# EAGLE design Sensor PCB (EAGLE 7.6.0)
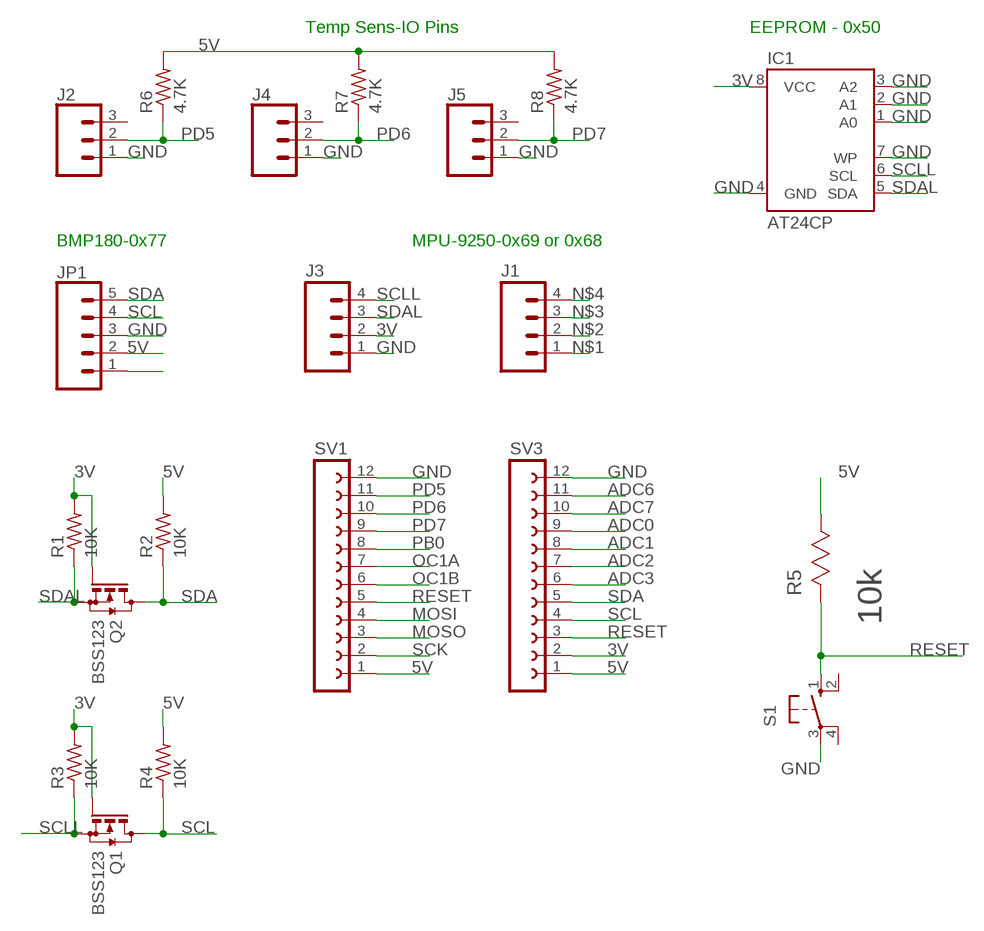
[diagram p0: schematic, sheet 1]

## Parts
IC1  AT24CP  [DIL08]
J1  M04PTH  [1X04]
J2  CONN_03  [1X03]
J3  M04PTH  [1X04]
J4  CONN_03  [1X03]
J5  CONN_03  [1X03]
JP1  CONN_05  [1X05]
Q1  BSS123  [SOT23]
Q2  BSS123  [SOT23]
R1  10K  R-US_M1406  [M1406]
R2  10K  R-US_M1406  [M1406]
R3  10K  R-US_M1406  [M1406]
R4  10K  R-US_M1406  [M1406]
R5  10k  CRCW08051M00JNEA  [RESC2013X65N]
R6  4.7K  R-US_M1406  [M1406]
R7  4.7K  R-US_M1406  [M1406]
R8  4.7K  R-US_M1406  [M1406]
S1  10-XX  [B3F-10XX]
SV1  FE12-1  [FE12]
SV3  FE12-1  [FE12]

## Nets
3V: IC1.8(VCC) J3.2 Q1.1(G) Q2.1(G) R1.2 R3.2 SV3.2
5V: JP1.2 R2.2 R4.2 R5.1 R6.2 R7.2 R8.2 SV1.1 SV3.1
ADC0: SV3.9
ADC1: SV3.8
ADC2: SV3.7
ADC3: SV3.6
ADC6: SV3.11
ADC7: SV3.10
GND: IC1.1(A0) IC1.2(A1) IC1.3(A2) IC1.4(GND) IC1.7(WP) J2.1 J3.1 J4.1 J5.1 JP1.3 S1.3(P) SV1.12 SV3.12
MOSI: SV1.4
MOSO: SV1.3
N$1: J1.1
N$2: J1.2
N$3: J1.3
N$4: J1.4
N$5: JP1.1
OC1A: SV1.7
OC1B: SV1.6
PB0: SV1.8
PD5: J2.2 R6.1 SV1.11
PD6: J4.2 R7.1 SV1.10
PD7: J5.2 R8.1 SV1.9
RESET: R5.2 S1.1(S) SV1.5 SV3.3
SCK: SV1.2
SCL: JP1.4 Q1.3(D) R4.1 SV3.4
SCLL: IC1.6(SCL) J3.4 Q1.2(S) R3.1
SDA: JP1.5 Q2.3(D) R2.1 SV3.5
SDAL: IC1.5(SDA) J3.3 Q2.2(S) R1.1
Unconnected: J2.3 J4.3 J5.3 S1.2(S1) S1.4(P1)

## Notes on the sheet
- Temp Sens-IO Pins | EEPROM - 0x50
- BMP180-0x77 | MPU-9250-0x69 or 0x68

## Library data of the parts
IC1 = atmel:AT24C*: 2-wire serial EEPROM; MPN: AT24C1024BW-SH-B; OC_FARNELL: 1362646; OC_NEWARK: 03P2044
J1 J3 = SparkFun-Connectors:M04: Header 4 Standard 4-pin 0.1" header. Use with straight break away headers (SKU : PRT-00116), right angle break away headers (PRT-00553), swiss pins (PRT-00743), machine pins (PRT-00117), and female headers (PRT-00115). Molex polarized connector foot print use with SKU : PRT-08231 with associated crimp pins and housings. 1MM SMD Version SKU: PRT-10208; PROD_ID: CONN-09696
J2 J4 J5 = SparkFun-Connectors:CONN_03: Multi connection point. Often used as Generic Header-pin footprint for 0.1 inch spaced/style header connections On any of the 0.1 inch spaced packages, you can populate with these: Break Away Headers - Straight <https://www.sparkfun.com/products/116> (PRT-00116) Break Away Male Headers - Right Angle <https://www.sparkfun.com/products/553> (PRT-00553) Female Headers <https://www.sparkfun.com/products/115> (PRT-00115) Break Away Headers - Machine Pin <https://www.sparkfun.com/products/117> (PRT-00117) Break Away Female Headers - Swiss Machine Pin <https://www.sparkfun.com/products/743> (PRT-00743) Stackable Header - 3 Pin (Female, 0.1") <https://www.sparkfun.com/products/13875> (PRT-13875) For SCREWTERMINALS and SPRING TERMINALS visit here: Screw Terimnals on SparkFun.com <https://www.sparkfun.com/search/results?term=Screw+Terminals> (5mm/3.5mm/2.54mm spacing) This device is also useful as a general connection point to wire up your design to another part of your project. Our various solder wires solder well into these plated through hole pads. Hook-Up Wire - Assortment (Stranded, 22 AWG) <https://www.sparkfun.com/products/11375> (PRT-11375) Hook-Up Wire - Assortment (Solid Core, 22 AWG) <https://www.sparkfun.com/products/11367> (PRT-11367) View the entire wire category on our website here <https://www.sparkfun.com/categories/141> Special notes: Molex polarized connector foot print use with SKU : PRT-08232 with associated crimp pins and housings.
JP1 = SparkFun-Connectors:CONN_05: Multi connection point. Often used as Generic Header-pin footprint for 0.1 inch spaced/style header connections On any of the 0.1 inch spaced packages, you can populate with these: Break Away Headers - Straight <https://www.sparkfun.com/products/116> (PRT-00116) Break Away Male Headers - Right Angle <https://www.sparkfun.com/products/553> (PRT-00553) Female Headers <https://www.sparkfun.com/products/115> (PRT-00115) Break Away Headers - Machine Pin <https://www.sparkfun.com/products/117> (PRT-00117) Break Away Female Headers - Swiss Machine Pin <https://www.sparkfun.com/products/743> (PRT-00743) For SCREWTERMINALS and SPRING TERMINALS visit here: Screw Terimnals on SparkFun.com <https://www.sparkfun.com/search/results?term=Screw+Terminals> (5mm/3.5mm/2.54mm spacing) This device is also useful as a general connection point to wire up your design to another part of your project. Our various solder wires solder well into these plated through hole pads. Hook-Up Wire - Assortment (Stranded, 22 AWG) <https://www.sparkfun.com/products/11375> (PRT-11375) Hook-Up Wire - Assortment (Solid Core, 22 AWG) <https://www.sparkfun.com/products/11367> (PRT-11367) View the entire wire category on our website here <https://www.sparkfun.com/categories/141> Special notes: Molex polarized connector foot print use with SKU : PRT-08231 with associated crimp pins and housings. 1MM SMD Version SKU: PRT-10208
Q1 Q2 = transistor-small-signal:BSS123: N-CHANNEL MOS FET
R1-R4 R6-R8 = resistor:R-US_: RESISTOR, American symbol
R5 = Vishay_By_element14_Batch_1:CRCW08051M00JNEA: RESISTOR, 0805; MPN: CRCW08051M00JNEA; OC_FARNELL: 1514803; OC_NEWARK: 59M6845; SUPPLIER: Vishay; TOLERANCE: ± 5.0 %; VALUE: 1M Ohms; WATTAGE: 0.125W
S1 = switch-omron:10-XX: OMRON SWITCH; MPN: B3F-1000; OC_FARNELL: 176432; OC_NEWARK: 36M3542
SV1 SV3 = con-lsta:FE12-1: FEMALE HEADER; OC_FARNELL: unknown; OC_NEWARK: unknown

## Board
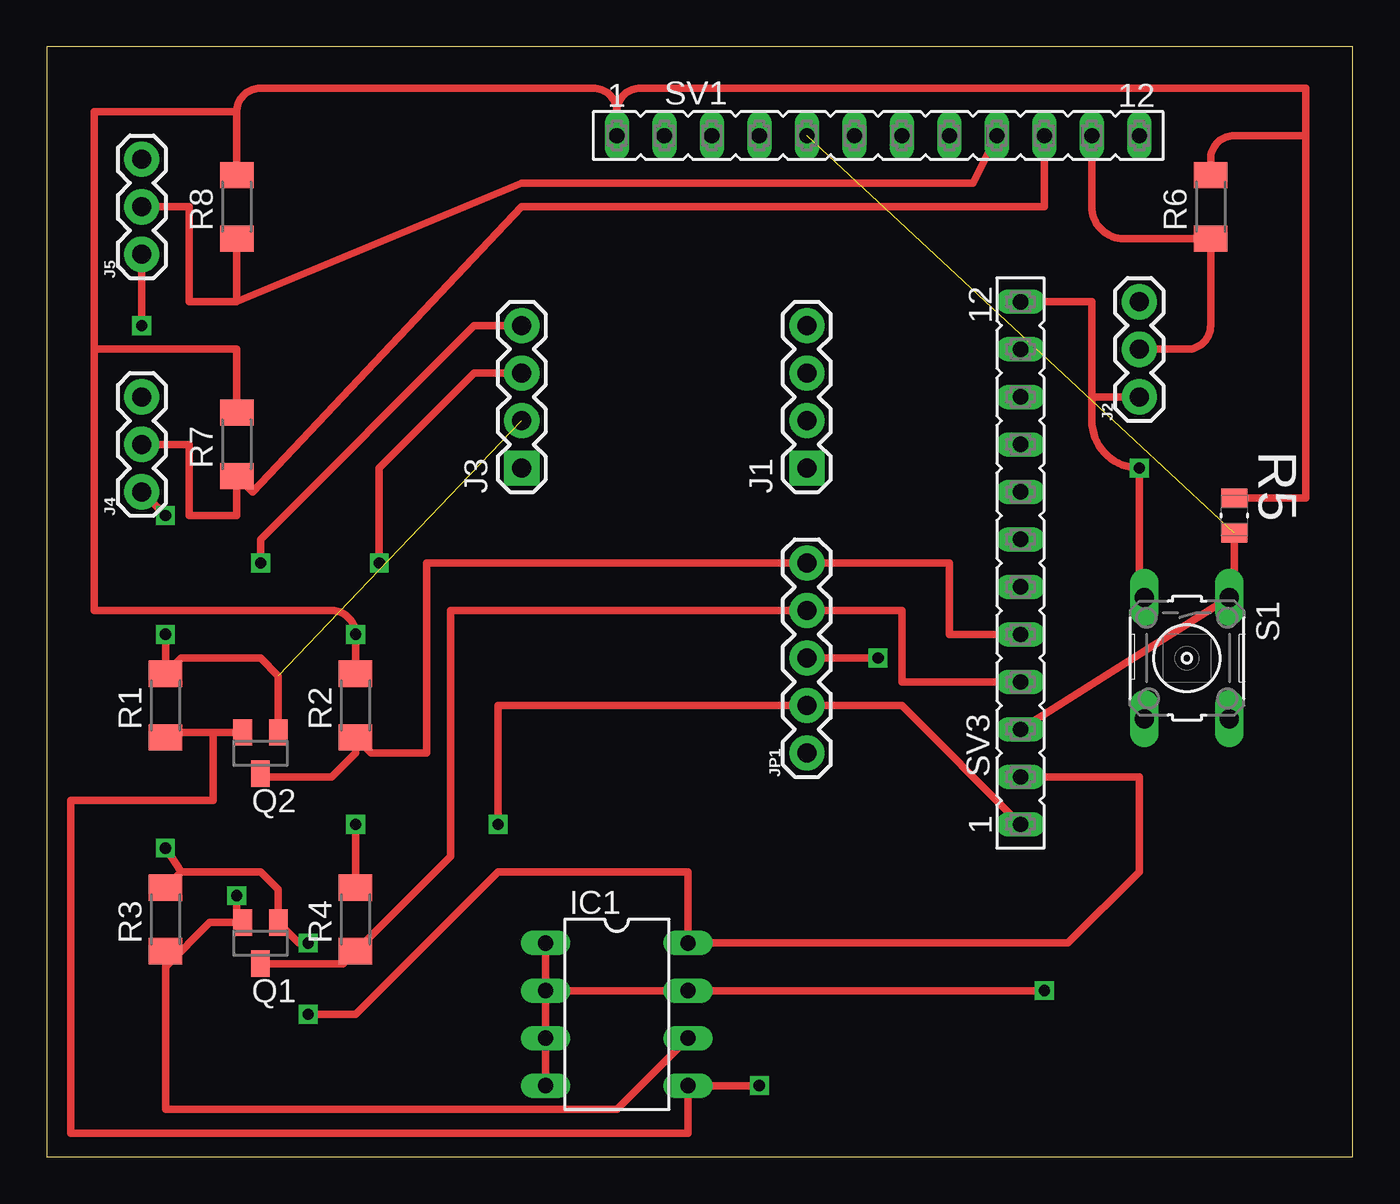
[diagram p1: board, top side]
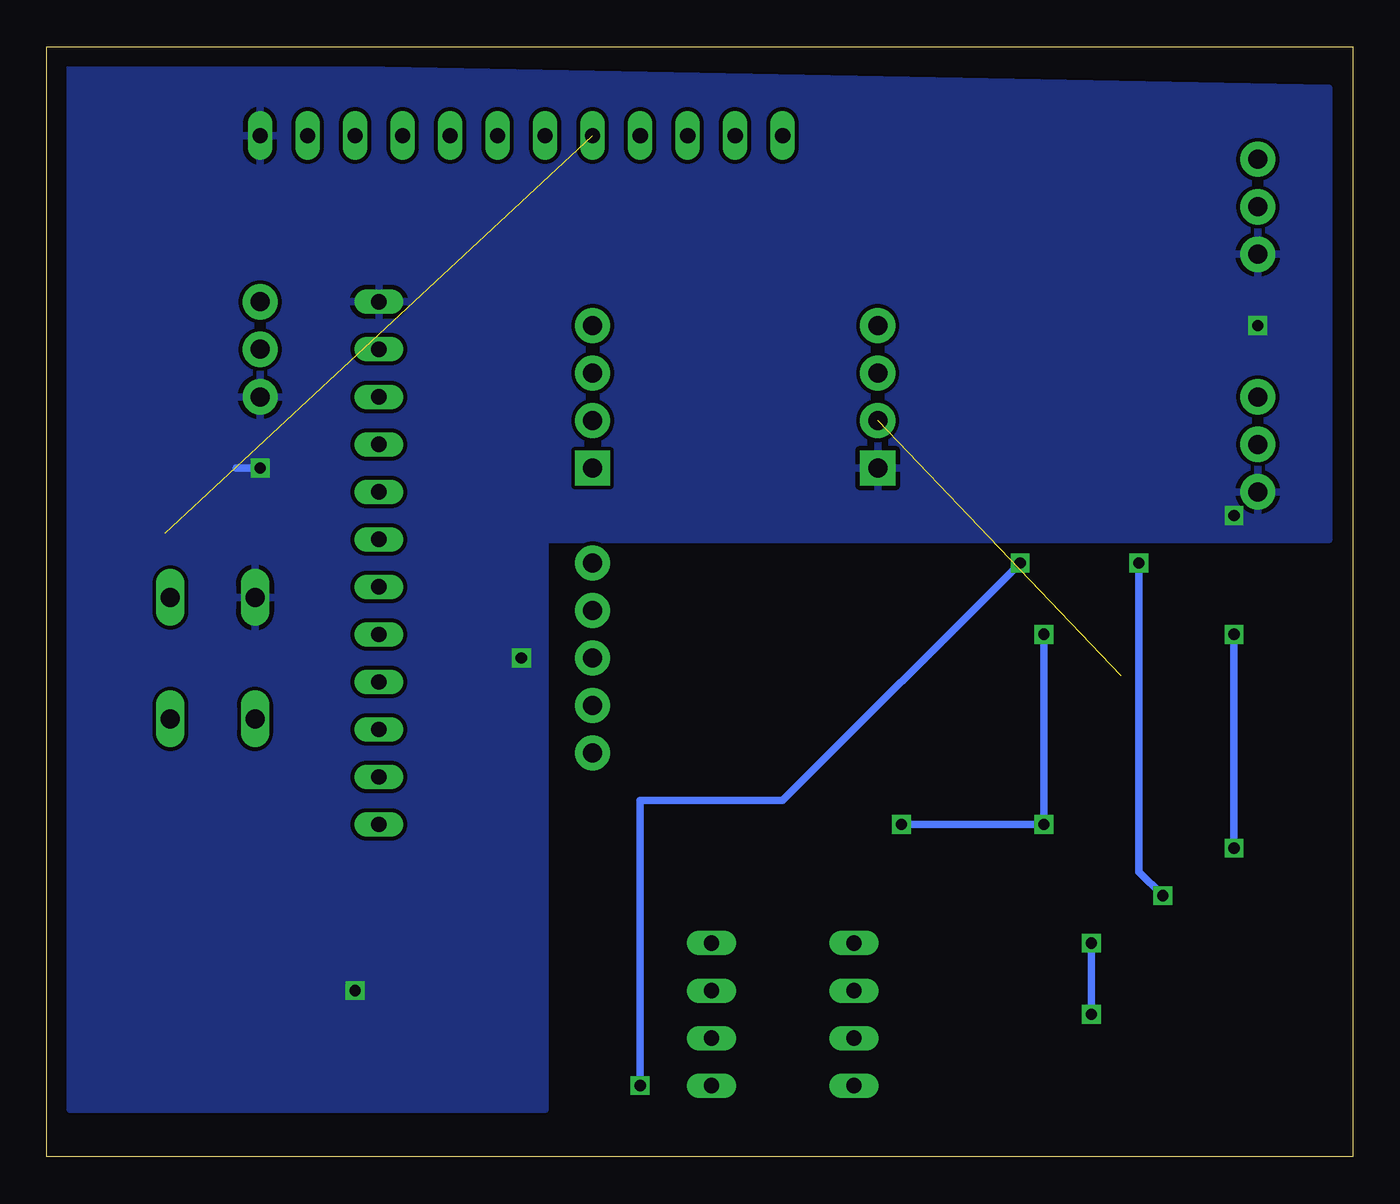
[diagram p2: board, bottom side, seen from below]

Size 69.83 x 59.36 mm. Coordinates in mm from the lower left corner, seen from the top.
Outline: 0,0 69.83,0 69.83,59.36 0,59.36 0,0
Copper layers (1*16): Top 0.035mm / dielectric 1.5mm / Bottom 0.035mm
Design rules "default": minimum track width 10mil, minimum drill 24mil, track to track 8mil, track to pad 8mil, pad to pad 8mil, via to via 8mil, smd to smd 8mil, copper to edge 40mil, drill to drill 8mil, minimum pad ring 10mil, minimum via ring 8mil, stop-mask expansion 4mil, vias tented up to drill 0mil, thermal gap 10mil

### Footprints (pad centres in the part's own frame; a part is rotated, then mirrored left to right if it is on the bottom)
DIL08 = drill 0.813 long: 1 -3.81,-3.81; 2 -1.27,-3.81; 3 1.27,-3.81; 4 3.81,-3.81; 5 3.81,3.81; 6 1.27,3.81; 7 -1.27,3.81; 8 -3.81,3.81
1X04 = drill 1.016 pad 1.88 square: 1 0,0 | drill 1.016 pad 1.88: 2 2.54,0; 3 5.08,0; 4 7.62,0
1X03 = drill 1.016 pad 1.88: 1 0,0; 2 2.54,0; 3 5.08,0
1X05 = drill 1.016 pad 1.88: 1 0,0; 2 2.54,0; 3 5.08,0; 4 7.62,0; 5 10.16,0
SOT23 = smd 1 x 1.4: 1 -0.95,-1.1; 2 0.95,-1.1; 3 0,1.1
M1406 = smd 1.4 x 1.8: 1 -1.7,0; 2 1.7,0
RESC2013X65N = smd 1.016 x 1.397: 1 -0.94,0; 2 0.94,0
B3F-10XX = drill 1.016 long: 1 -3.251,2.261; 2 3.251,2.261; 3 -3.251,-2.261; 4 3.251,-2.261
FE12 = drill 0.813 long: 1 -13.97,0; 2 -11.43,0; 3 -8.89,0; 4 -6.35,0; 5 -3.81,0; 6 -1.27,0; 7 1.27,0; 8 3.81,0; 9 6.35,0; 10 8.89,0; 11 11.43,0; 12 13.97,0

### Placement (x,y rotation side)
IC1  30.48,7.62 270 top
J1  40.64,36.83 90 top
J2  58.42,40.64 90 top
J3  25.4,36.83 90 top
J4  5.08,35.56 90 top
J5  5.08,48.26 90 top
JP1  40.64,21.59 90 top
Q1  11.43,11.43 180 top
Q2  11.43,21.59 180 top
R1  6.35,24.13 90 top
R2  16.51,24.13 90 top
R3  6.35,12.7 90 top
R4  16.51,12.7 90 top
R5  63.5,34.29 270 top
R6  62.23,50.8 90 top
R7  10.16,38.1 90 top
R8  10.16,50.8 90 top
S1  60.96,26.67 270 top
SV1  44.45,54.61 0 top
SV3  52.07,31.75 90 top

### Tracks (layer width: path | path; a pad name or v marks a point on that pad's centre or on a via)
3V  (via drill 0.6)  (1 unrouted)
  Top 0.406: Q2.1 12.38,25.72 11.43,26.67 7.19,26.67 R1.2 v6.35,27.94 | 7.19,15.24 11.43,15.24 12.38,14.29 Q1.1 13.48,11.43 v13.97,11.43 | 7.19,15.24 R3.2 | SV3.2 58.42,20.32 58.42,15.24 54.61,11.43 IC1.8 34.29,15.24 24.13,15.24 16.51,7.62 v13.97,7.62 | 7.19,15.24 v6.35,16.51
  Bottom 0.406: v6.35,27.94 v6.35,16.51 | v13.97,11.43 v13.97,7.62
5V  (via drill 0.6)
  Top 0.406: 30.48,55.88 arc-90 31.75,57.15 67.31,57.15 67.31,54.61 | SV1.1 30.48,55.88 | 30.48,55.88 arc90 29.21,57.15 11.43,57.15 arc90 10.16,55.88 | 10.16,55.88 R8.2 | SV3.1 45.72,24.13 JP1.2 24.13,24.13 v24.13,17.78 | R5.1 67.31,35.23 67.31,54.61 | R6.2 62.23,53.34 arc-90 63.5,54.61 67.31,54.61 | 2.54,43.18 10.16,43.18 R7.2 | 2.54,43.18 2.54,55.88 10.16,55.88 | R4.2 v16.51,17.78 | R2.2 v16.51,27.94 arc90 15.24,29.21 2.54,29.21 2.54,43.18
  Bottom 0.406: v16.51,27.94 v16.51,17.78 v24.13,17.78
GND  (via drill 0.6)
  Top 0.406: S1.3 arc-90 58.42,30.2 v58.42,36.83 arc-90 55.88,39.37 55.88,40.64 | 55.88,40.64 55.88,45.72 SV3.12 | J2.1 55.88,40.64 | v5.08,44.45 J5.1 | v6.35,34.29 J4.1 | IC1.4 IC1.3 IC1.2 | IC1.2 IC1.1 | IC1.2 IC1.7 v53.34,8.89 | JP1.3 v44.45,26.67
  Bottom 0.406: v58.42,36.83 59.69,36.83
  pour Bottom: 1.27,57.15 68.58,58.42 68.58,2.54 43.18,2.54 43.18,33.02 1.27,33.02
PD5
  Top 0.406: J2.2 60.96,43.18 arc90 62.23,44.45 R6.1 57.58,49.1 arc-90 55.88,50.8 SV1.11
PD6
  Top 0.406: SV1.10 53.34,50.8 25.4,50.8 11,35.56 R7.1 10.16,34.29 7.62,34.29 7.62,38.1 J4.2
PD7
  Top 0.406: R8.1 10.16,45.72 | 10.16,45.72 7.62,45.72 7.62,50.8 J5.2 | 10.16,45.72 25.4,52.07 49.53,52.07 SV1.9
RESET  (1 unrouted)
  Top 0.406: SV3.3 S1.1 63.5,29.92 R5.2
SCL
  Top 0.406: SV3.4 45.72,25.4 45.72,29.21 JP1.4 21.59,29.21 21.59,16.08 R4.1 15.84,10.33 Q1.3
SCLL  (via drill 0.6)
  Top 0.406: 6.35,10.16 R3.1 | 6.35,10.16 6.35,2.54 30.48,2.54 IC1.6 | 6.35,10.16 8.72,12.53 Q1.2 10.16,12.85 v10.16,13.97 | v11.43,31.75 11.43,33.02 22.86,44.45 J3.4
  Bottom 0.406: v10.16,13.97 11.43,15.24 v11.43,31.75
SDA
  Top 0.406: SV3.5 48.26,27.94 48.26,31.75 JP1.5 20.32,31.75 20.32,21.59 17.35,21.59 R2.1 16.51,21.59 15.24,20.32 11.6,20.32 Q2.3
SDAL  (via drill 0.6)
  Top 0.406: Q2.2 8.89,22.69 | 8.89,22.69 6.61,22.69 R1.1 | 8.89,22.69 8.89,19.05 1.27,19.05 1.27,1.27 34.29,1.27 IC1.5 v38.1,3.81 | v17.78,31.75 17.78,36.83 22.86,41.91 J3.3
  Bottom 0.406: v17.78,31.75 30.48,19.05 38.1,19.05 v38.1,3.81